# EAGLE schematic ESP32CAM-Motorhat (EAGLE 9.6.2)
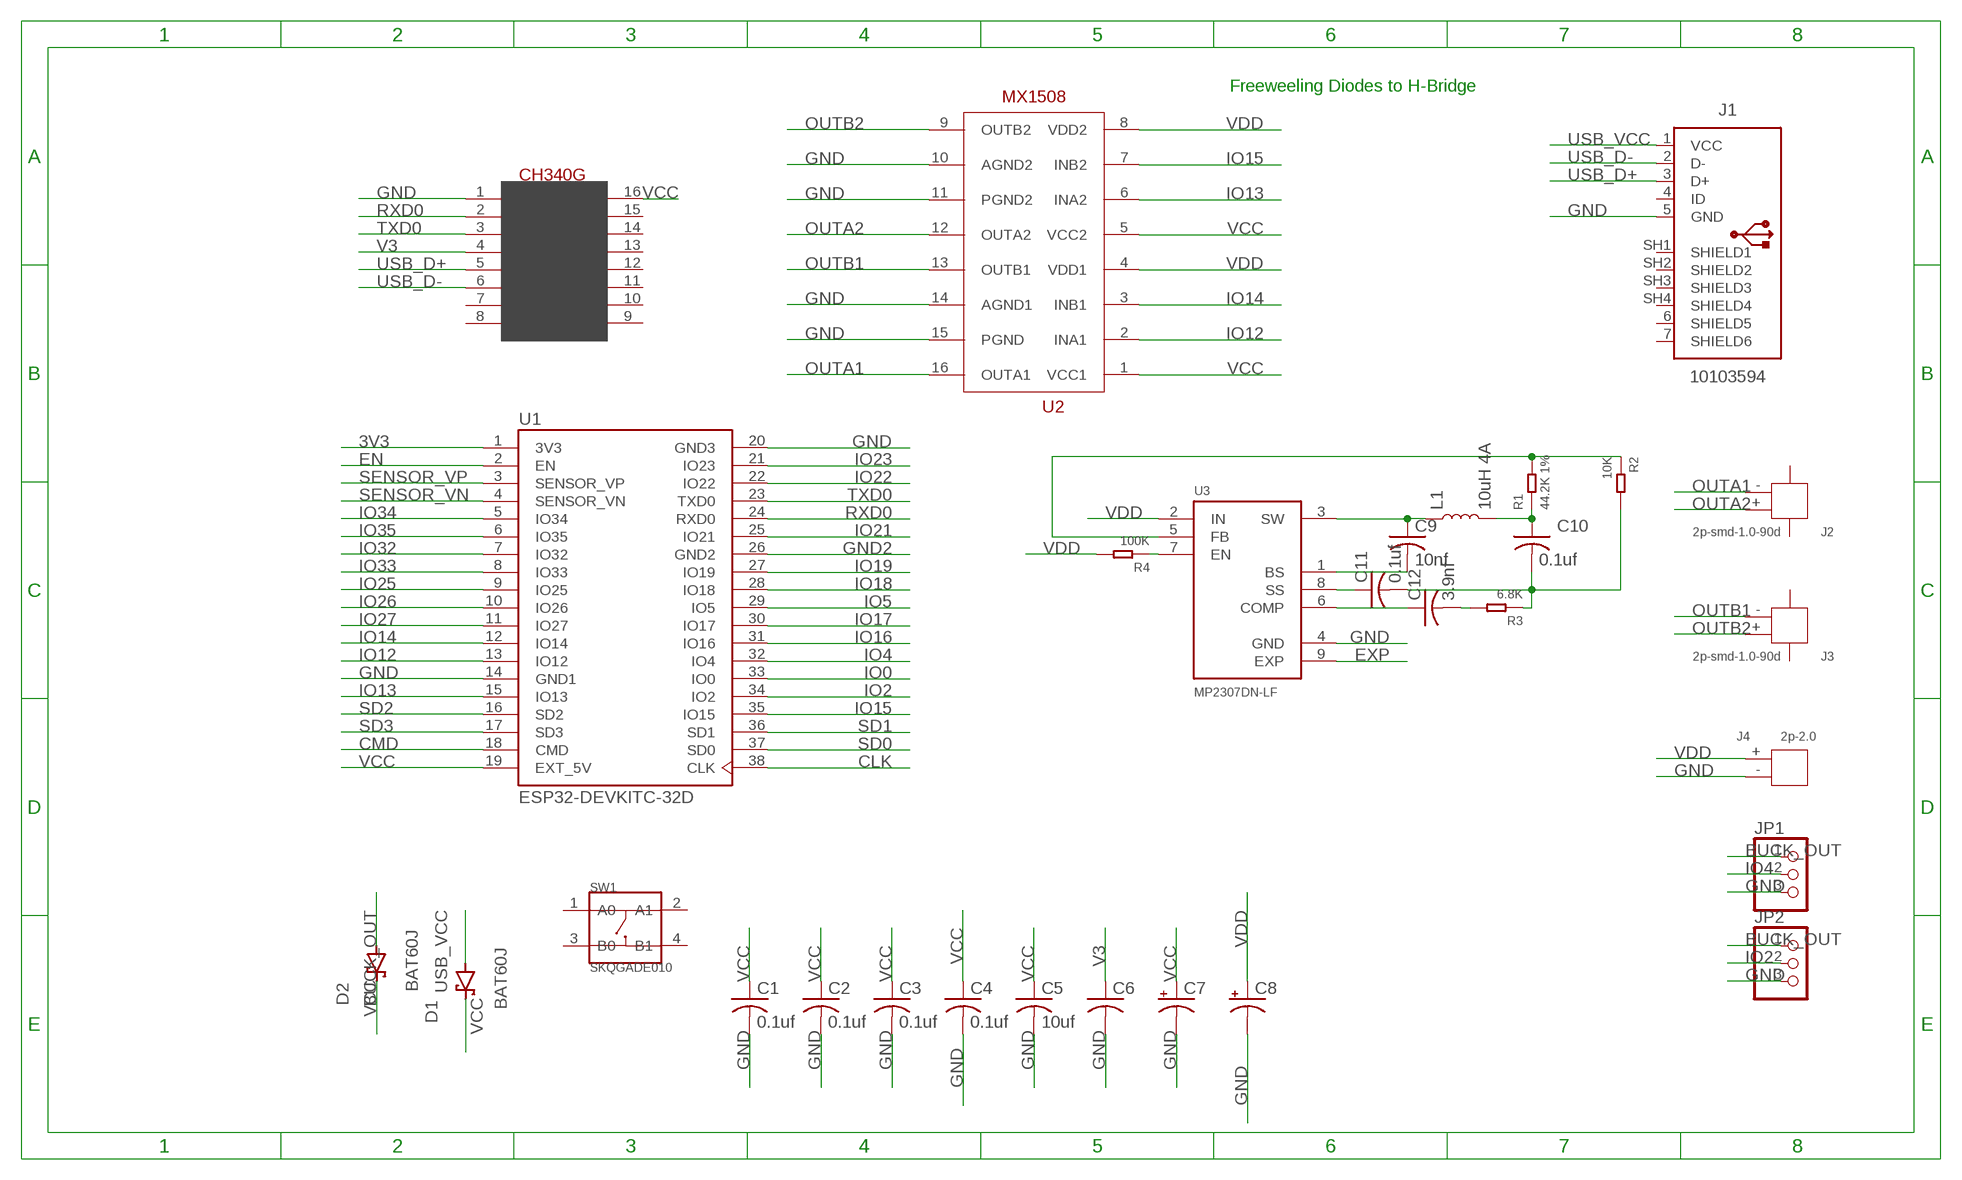
[diagram p0: schematic, sheet 1]

## Parts
C1  0.1uf  C-USC1206  [C1206]
C2  0.1uf  C-USC1206  [C1206]
C3  0.1uf  C-USC1206  [C1206]
C4  0.1uf  C-USC1206  [C1206]
C5  10uf  C-USC1206  [C1206]
C6  C-USC1206  [C1206]
C7  CPOL-USD  [PANASONIC_D]
C8  CPOL-USD  [PANASONIC_D]
C9  10nf  C-USC1206  [C1206]
C10  0.1uf  C-USC1206  [C1206]
C11  0.1uf  C-USC1206  [C1206]
C12  3.9nf  C-USC1206  [C1206]
D1  BAT60J  [SOD323_ST]
D2  BAT60J  [SOD323_ST]
J1  10103594  [10103594]
J2  2p-smd-1.0-90d  SMD-JST-2P-1.0-90D  [HW2-SMD-1.0-90D]
J3  2p-smd-1.0-90d  SMD-JST-2P-1.0-90D  [HW2-SMD-1.0-90D]
J4  2p-2.0  DIP-JST-2P-2.0  [H2-2.0-6X4.5MM]
JP1  PINHD-1X3CB  [1X03-CLEANBIG]
JP2  PINHD-1X3CB  [1X03-CLEANBIG]
L1  10uH 4A  19NH-0402  [0402_MURATA]
R1  44.2K 1%  SMD-RES-0R-1%-1/8W(0805)  [R0805]
R2  10K  SMD-RES-0R-1%-1/8W(0805)  [R0805]
R3  6.8K  SMD-RES-0R-1%-1/8W(0805)  [R0805]
R4  100K  SMD-RES-0R-1%-1/8W(0805)  [R0805]
SW1  SKQGADE010  SMD-BUTTON(4P-5.2X5.2X1.5MM-SKQGADE010)-SKQGADE010  [SW4-SMD-5.2X5.2X1.5MM]
U1  ESP32-DEVKITC-32D  [MODULE_ESP32-DEVKITC-32D]
U2  MX1508  [SOP-16]
U3  MP2307DN-LF  [SOIC127P600X170-9N]
U4  CH340G  [SOIC16]

## Nets
3V3: U1.1(3V3)
BUCK_OUT: C10.1 D2.A JP1.1 JP2.1 L1.P$2 R1.1
CLK: U1.38(CLK)
CMD: U1.18(CMD)
EN: U1.2(EN)
EXP: U3.9(EXP)
GND [GND]: C1.2 C2.2 C3.2 C4.2 C5.2 C6.2 C7.- C8.- J1.5(GND) J4.- JP1.3 JP2.3 U1.14(GND1) U1.20(GND3) U2.10(AGND2) U2.11(PGND2) U2.14(AGND1) U2.15(PGND) U3.4(GND) U4.1(GND)
GND2: U1.26(GND2)
IO0: U1.33(IO0)
IO2: JP2.2 U1.34(IO2)
IO4: JP1.2 U1.32(IO4)
IO5: U1.29(IO5)
IO12: U1.13(IO12) U2.2(INA1)
IO13: U1.15(IO13) U2.6(INA2)
IO14: U1.12(IO14) U2.3(INB1)
IO15: U1.35(IO15) U2.7(INB2)
IO16: U1.31(IO16)
IO17: U1.30(IO17)
IO18: U1.28(IO18)
IO19: U1.27(IO19)
IO21: U1.25(IO21)
IO22: U1.22(IO22)
IO23: U1.21(IO23)
IO25: U1.9(IO25)
IO26: U1.10(IO26)
IO27: U1.11(IO27)
IO32: U1.7(IO32)
IO33: U1.8(IO33)
IO34: U1.5(IO34)
IO35: U1.6(IO35)
N$1: C9.1 L1.P$1 U3.3(SW)
N$3: C9.2 U3.1(BS)
N$4: C11.1 U3.8(SS)
N$5: C10.2 C11.2 R2.2 R3.1
N$6: R1.2 R2.1 U3.5(FB)
N$7: R4.1 U3.7(EN)
N$8: C12.1 U3.6(COMP)
N$9: C12.2 R3.2
OUTA1: J2.- U2.16(OUTA1)
OUTA2: J2.+ U2.12(OUTA2)
OUTB1: J3.- U2.13(OUTB1)
OUTB2: J3.+ U2.9(OUTB2)
RXD0: U1.24(RXD0) U4.2(TX)
SD0: U1.37(SD0)
SD1: U1.36(SD1)
SD2: U1.16(SD2)
SD3: U1.17(SD3)
SENSOR_VN: U1.4(SENSOR_VN)
SENSOR_VP: U1.3(SENSOR_VP)
TXD0: U1.23(TXD0) U4.3(RX)
USB_D+ [USB_+]: J1.3(D+) U4.5(D+)
USB_D- [USB_-]: J1.2(D-) U4.6(D-)
USB_VCC [VCC]: D1.A J1.1(VCC)
V3: C6.1 U4.4(V3)
VCC [VCC]: C1.1 C2.1 C3.1 C4.1 C5.1 C7.+ D1.C D2.C U1.19(EXT_5V) U2.1(VCC1) U2.5(VCC2) U4.16(VCC)
VDD [VSS]: C8.+ J4.+ R4.2 U2.4(VDD1) U2.8(VDD2) U3.2(IN)
Unconnected: J1.4(ID) J1.6(SHIELD5) J1.7(SHIELD6) J1.SH1(SHIELD1) J1.SH2(SHIELD2) J1.SH3(SHIELD3) J1.SH4(SHIELD4) J2.3 J2.4 J3.3 J3.4 SW1.1(A0) SW1.2(A1) SW1.3(B0) SW1.4(B1) U4.7(XI) U4.8(XO) U4.9(CTS) U4.10(DSR) U4.11(RI) U4.12(DCD) U4.13(DTR) U4.14(RTS) U4.15(RS232)

## Notes on the sheet
- Freeweeling Diodes to H-Bridge

## Library data of the parts
C1 C9-C12 = adafruit:C-US: CAPACITOR, American symbol; LOCATION: U2
C2 = adafruit:C-US: CAPACITOR, American symbol; LOCATION: u3
C3 C5 = adafruit:C-US: CAPACITOR, American symbol; LOCATION: U4
C4 C6 = adafruit:C-US: CAPACITOR, American symbol
C7 C8 = adafruit:CPOL-US: POLARIZED CAPACITOR, American symbol; LOCATION: U2
D1 D2 = diode:BAT60J: Schottky barrier diode Source: www.st.com, BAT60J.pdf
J1 = Connector_USB:10103594: USB(2.0) Micro-B, RCPT, 5POS, SMD-THT-R/A Datasheet <https://cdn.amphenol-icc.com/media/wysiwyg/files/documentation/datasheet/inputoutput/io_usb_micro.pdf> Drawing <https://cdn.amphenol-icc.com/media/wysiwyg/files/drawing/10103594.pdf>; CATEGORY: Connectors; CONTACTS: 5; CURRENT-RATING: 1.8A; DESCRIPTION: CONN RCPT USB2.0 MICRO B SMD R/A; GENDER: Receptacle; MANUFACTURER: Amphenol ICC (FCI); MOUNT_TYPE: R/A; MPN: 10103594-0001LF; OPERATING_TEMPERATURE: -30°C ~ 80°C; PART_STATUS: ACTIVE; ROHS_COMPLIANT: COMPLIANT; SUB_CATEGORY: USB; TYPE: USB-micro B; VOLTAGE-RATING: 100VAC
J2 J3 = OPL_Connector:SMD-JST-2P-1.0-90D: 320110054
J4 = OPL_Connector:DIP-JST-2P-2.0: 320110049; SPICEPREFIX: B
JP1 JP2 = adafruit:PINHD-1X3: PIN HEADER
L1 = SparkFun-Coils:19NH; PROD_ID: NDUC-14352; VALUE: 19 nH
R1-R4 = OPL_Resistor:SMD-RES-0R-1%-1/8W(0805): 301012149; MPN: RC0805JR-071KL; VALUE: 1K
SW1 = OPL_Switch:SMD-BUTTON(4P-5.2X5.2X1.5MM-SKQGADE010): 311020017; MPN: SKQGADE010
U1 = ESP32-DEVKITC-32D:ESP32-DEVKITC-32D: Eval Board For Esp-Wroom-32 Check prices <https://pricing.snapeda.com/parts/ESP32-DEVKITC-32D/Espressif%20Systems/view-part?ref=eda>; AVAILABILITY: Warning; DESCRIPTION: WiFi Development Tools (802.11) ESP32 General Development Kit, ESP32-WROOM-32D on the board; MF: Espressif Systems; MP: ESP32-DEVKITC-32D; PACKAGE: None; PRICE: None; PURCHASE-URL: https://pricing.snapeda.com/search/part/ESP32-DEVKITC-32D/?ref=eda
U2 = MX1508:MX1508; AVAILABILITY: Unavailable; MF: Sinotech Mixic Electronics Co., Ltd; MP: MX1508; PACKAGE: Package; PRICE: None
U3 = MP2307DN-LF:MP2307DN-LF: MP2307 Series 23V 340 kHz 3A Synchronous Rectified Step-Down Converter - SOIC-8 Check prices <https://pricing.snapeda.com/parts/MP2307DN-LF/Monolithic%20Power/view-part?ref=eda>; AVAILABILITY: Bad; DESCRIPTION: Buck Switching Regulator IC Positive Adjustable 0.925V 1 Output 3A 8-SOIC (0.154, 3.90mm Width) Exposed Pad; MF: Monolithic Power; MP: MP2307DN-LF; PACKAGE: SOIC-8 Monolithic Power; PRICE: None
U4 = usb-serial:CH340G